# EAGLE design covert2temprouted (EAGLE 9.6.2)
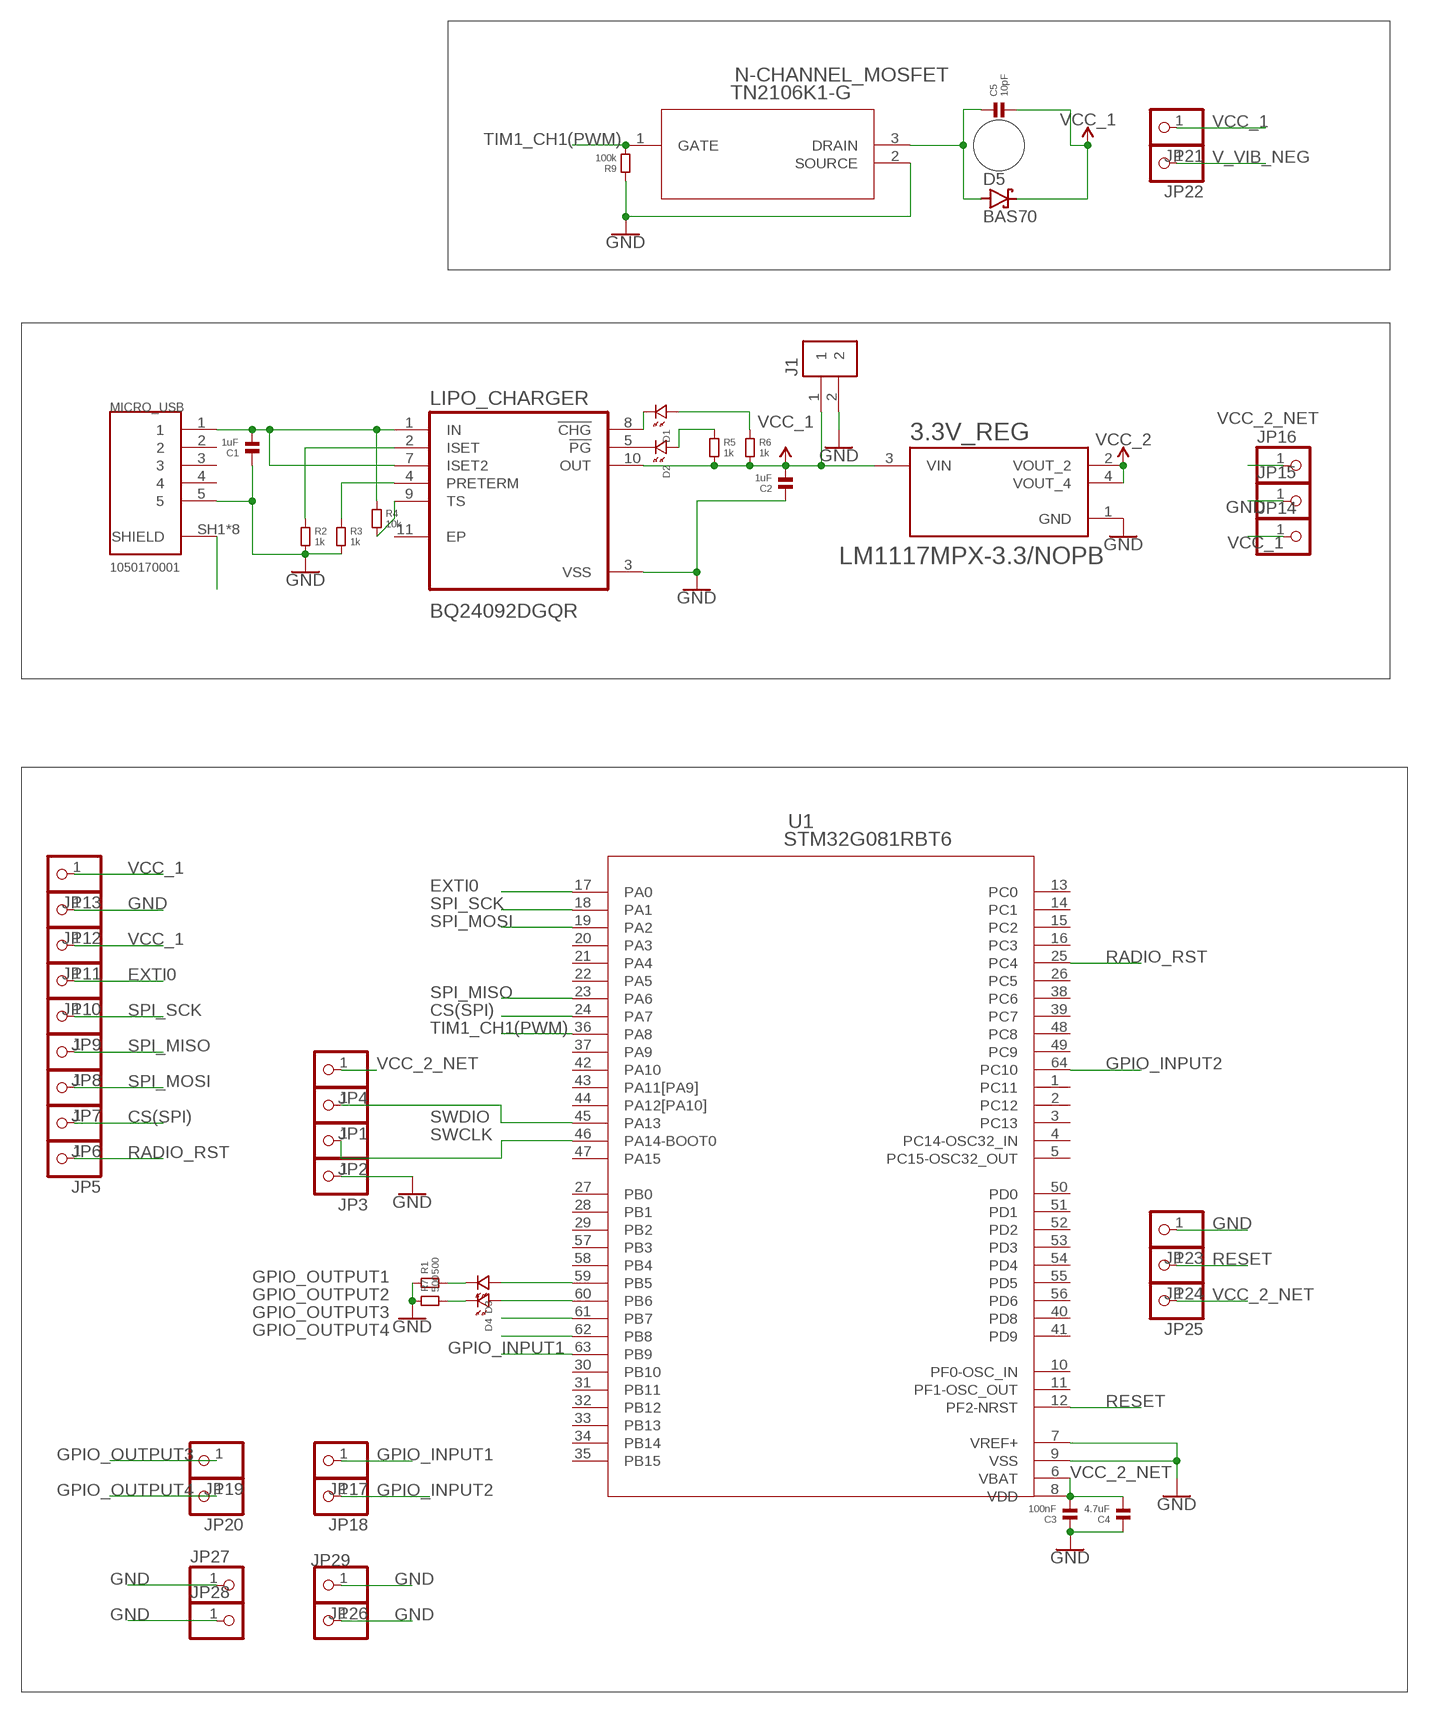
[diagram p0: schematic, sheet 1]

## Parts
3.3V_REG  LM1117MPX-3.3/NOPB  [VREG_LM1117MPX-3.3/NOPB]
C1  1uF  CAPACITOR.0805  [0805]
C2  1uF  CAPACITOR.0805  [0805]
C3  100nF  CAPACITOR.0805  [0805]
C4  4.7uF  CAPACITOR.0805  [0805]
C5  10pF  CAPACITOR.0805  [0805]
D1  LED.0805  [0805.LED]
D2  LED.0805  [0805.LED]
D3  LED.0805  [0805.LED]
D4  LED.0805  [0805.LED]
D5  BAS70  [SOT23]
J1  B2B-PH-K-S(LF)(SN)  [JST_B2B-PH-K-S(LF)(SN)]
JP1  PINHD-1X1  [1X01]
JP2  PINHD-1X1  [1X01]
JP3  PINHD-1X1  [1X01]
JP4  PINHD-1X1  [1X01]
JP5  PINHD-1X1  [1X01]
JP6  PINHD-1X1  [1X01]
JP7  PINHD-1X1  [1X01]
JP8  PINHD-1X1  [1X01]
JP9  PINHD-1X1  [1X01]
JP10  PINHD-1X1  [1X01]
JP11  PINHD-1X1  [1X01]
JP12  PINHD-1X1  [1X01]
JP13  PINHD-1X1  [1X01]
JP14  PINHD-1X1  [1X01]
JP15  PINHD-1X1  [1X01]
JP16  PINHD-1X1  [1X01]
JP17  PINHD-1X1  [1X01]
JP18  PINHD-1X1  [1X01]
JP19  PINHD-1X1  [1X01]
JP20  PINHD-1X1  [1X01]
JP21  PINHD-1X1  [1X01]
JP22  PINHD-1X1  [1X01]
JP23  PINHD-1X1  [1X01]
JP24  PINHD-1X1  [1X01]
JP25  PINHD-1X1  [1X01]
JP26  PINHD-1X1  [1X01]
JP27  PINHD-1X1  [1X01]
JP28  PINHD-1X1  [1X01]
JP29  PINHD-1X1  [1X01]
LIPO_CHARGER  BQ24092DGQR  [IC_XTR111AIDGQR]
MICRO_USB  1050170001  [MOLEX_1050170001]
N-CHANNEL_MOSFET  TN2106K1-G  [TO-236AB_MCH]
R1  500  RESISTOR.0805  [0805]
R2  1k  RESISTOR.0805  [0805]
R3  1k  RESISTOR.0805  [0805]
R4  10k  RESISTOR.0805  [0805]
R5  1k  RESISTOR.0805  [0805]
R6  1k  RESISTOR.0805  [0805]
R7  500  RESISTOR.0805  [0805]
R9  100k  RESISTOR.0805  [0805]
U1  STM32G081RBT6  [LQFP-64]

## Nets
5VUSB: C1.2 LIPO_CHARGER.1(IN) LIPO_CHARGER.7(ISET2) MICRO_USB.1 R4.1
CS(SPI): JP6.1 U1.24(PA7)
EXTI0: JP10.1 U1.17(PA0)
GND: 3.3V_REG.1(GND) C1.1 C2.1 C3.1 C4.1 J1.2 JP3.1 JP12.1 JP15.1 JP23.1 JP26.1 JP27.1 JP28.1 JP29.1 LIPO_CHARGER.3(VSS) MICRO_USB.5 N-CHANNEL_MOSFET.2(SOURCE) R1.1 R2.2 R3.2 R7.1 R9.1 U1.7(VREF+) U1.9(VSS)
GPIO_INPUT1: JP17.1 U1.63(PB9)
GPIO_INPUT2: JP18.1 U1.64(PC10)
GPIO_OUTPUT1: D3.P$1 U1.59(PB5)
GPIO_OUTPUT2: D4.P$1 U1.60(PB6)
GPIO_OUTPUT3: JP19.1 U1.61(PB7)
GPIO_OUTPUT4: JP20.1 U1.62(PB8)
N$1: LIPO_CHARGER.2(ISET) R2.1
N$2: LIPO_CHARGER.4(PRETERM) R3.1
N$3: LIPO_CHARGER.9(TS) R4.2
N$4: D4.P$2 R7.2
N$5: D2.P$1 R5.1
N$6: D1.P$1 R6.1
N$7: D2.P$2 LIPO_CHARGER.5(!PG)
N$9: D3.P$2 R1.2
N$11: D1.P$2 LIPO_CHARGER.8(!CHG)
RADIO_RST: JP5.1 U1.25(PC4)
RESET: JP24.1 U1.12(PF2-NRST)
SHIELD: MICRO_USB.SH1(SHIELD) MICRO_USB.SH2(SHIELD) MICRO_USB.SH3(SHIELD) MICRO_USB.SH4(SHIELD) MICRO_USB.SH5(SHIELD) MICRO_USB.SH6(SHIELD) MICRO_USB.SH7(SHIELD) MICRO_USB.SH8(SHIELD)
SPI_MISO: JP8.1 U1.23(PA6)
SPI_MOSI: JP7.1 U1.19(PA2)
SPI_SCK: JP9.1 U1.18(PA1)
SWCLK: JP2.1 U1.46(PA14-BOOT0)
SWDIO: JP1.1 U1.45(PA13)
TIM1_CH1(PWM): N-CHANNEL_MOSFET.1(GATE) R9.2 U1.36(PA8)
V_VIB_NEG: C5.1 D5.1(A) JP22.1 N-CHANNEL_MOSFET.3(DRAIN)
VCC_1: 3.3V_REG.3(VIN) C2.2 C5.2 D5.3(C) J1.1 JP11.1 JP13.1 JP14.1 JP21.1 LIPO_CHARGER.10(OUT) R5.2 R6.2
VCC_2_NET: 3.3V_REG.2(VOUT_2) 3.3V_REG.4(VOUT_4) C3.2 C4.2 JP4.1 JP16.1 JP25.1 U1.6(VBAT) U1.8(VDD) ; supply symbol labelled VCC_2
Unconnected: LIPO_CHARGER.11(EP) MICRO_USB.2 MICRO_USB.3 MICRO_USB.4 U1.1(PC11) U1.2(PC12) U1.3(PC13) U1.4(PC14-OSC32_IN) U1.5(PC15-OSC32_OUT) U1.10(PF0-OSC_IN) U1.11(PF1-OSC_OUT) U1.13(PC0) U1.14(PC1) U1.15(PC2) U1.16(PC3) U1.20(PA3) U1.21(PA4) U1.22(PA5) U1.26(PC5) U1.27(PB0) U1.28(PB1) U1.29(PB2) U1.30(PB10) U1.31(PB11) U1.32(PB12) U1.33(PB13) U1.34(PB14) U1.35(PB15) U1.37(PA9) U1.38(PC6) U1.39(PC7) U1.40(PD8) U1.41(PD9) U1.42(PA10) U1.43(PA11[PA9]) U1.44(PA12[PA10]) U1.47(PA15) U1.48(PC8) U1.49(PC9) U1.50(PD0) U1.51(PD1) U1.52(PD2) U1.53(PD3) U1.54(PD4) U1.55(PD5) U1.56(PD6) U1.57(PB3) U1.58(PB4)

## Library data of the parts
3.3V_REG = LM1117MPX-3.3_NOPB (1):LM1117MPX-3.3/NOPB: 800-mA 15-V linear voltage regulator 4-SOT-223 0 to 125; DESCRIPTION: 800-mA 15-V linear voltage regulator 4-SOT-223 0 to 125; DIGI-KEY_PART_NUMBER: LM1117MPX-3.3/NOPBCT-ND; MF: Texas Instruments; MP: LM1117MPX-3.3/NOPB; PACKAGE: SOT-223-4 Texas Instruments; PURCHASE-URL: https://pricing.snapeda.com/search/part/LM1117MPX-3.3/NOPB/?ref=eda
C1-C5 = standardparts:CAPACITOR
D1-D4 = standardparts:LED
D5 = diode:BAS70: Silicon Schottky Diodes General-purpose diode for high-speed switching
J1 = B2B-PH-K-S_LF__SN_:B2B-PH-K-S(LF)(SN): PH Series 2 Position 2 mm Pitch Through Hole Top Entry Shrouded Header; DESCRIPTION: Connector Header Through Hole 2 position 0.079 (2.00mm); DIGI-KEY_PART_NUMBER: 455-1704-ND; MF: JST Sales; MP: B2B-PH-K-S(LF)(SN); PACKAGE: None; PURCHASE-URL: https://pricing.snapeda.com/search/part/B2B-PH-K-S(LF)(SN)/?ref=eda
JP1-JP29 = pinhead:PINHD-1X1: PIN HEADER
LIPO_CHARGER = BQ24092DGQR:BQ24092DGQR; DESCRIPTION: 1-cell, 1-A, Li-ion battery charger with operation over JEITA and 10k? NTC 10-HVSSOP -40 to 150; DIGI-KEY_PART_NUMBER: 296-41204-1-ND; MF: Texas Instruments; MP: BQ24092DGQR; PACKAGE: HVSSOP-10 Texas Instruments; PURCHASE-URL: https://pricing.snapeda.com/search/part/BQ24092DGQR/?ref=eda
MICRO_USB = 1050170001:1050170001: Conn.; Data; USB; Recept.; Micro; B Type; Bottom Mount, SMT, with Solder Tabs, Lead-Free; DESCRIPTION: USB - micro B USB 2.0 Receptacle Connector 5 Position Surface Mount, Right Angle; Through Hole; DIGI-KEY_PART_NUMBER: WM1399CT-ND; MF: Molex; MP: 1050170001; PACKAGE: None; PURCHASE-URL: https://pricing.snapeda.com/search/part/1050170001/?ref=eda
N-CHANNEL_MOSFET = TN2106K1-G (MOSFET):TN2106K1-G; BUILT_BY: EMA_Jessica; COPYRIGHT: Copyright (C) 2018 Accelerated Designs. All rights reserved; MANUFACTURER_PART_NUMBER: TN2106K1-G; SOURCELIBRARY: Update_to_database_2020-12-30; VENDOR: Microchip
R1-R7 R9 = standardparts:RESISTOR
U1 = STM32G081RBT6v3:STM32G081RBT6; BUILT_BY: EMA_UL_Team; COPYRIGHT: Copyright (C) 2018 Accelerated Designs. All rights reserved; MANUFACTURER_PART_NUMBER: STM32G081RBT6; SOURCELIBRARY: Updates_to_database_2020-10-19; VENDOR: STMicroelectronics

## Board
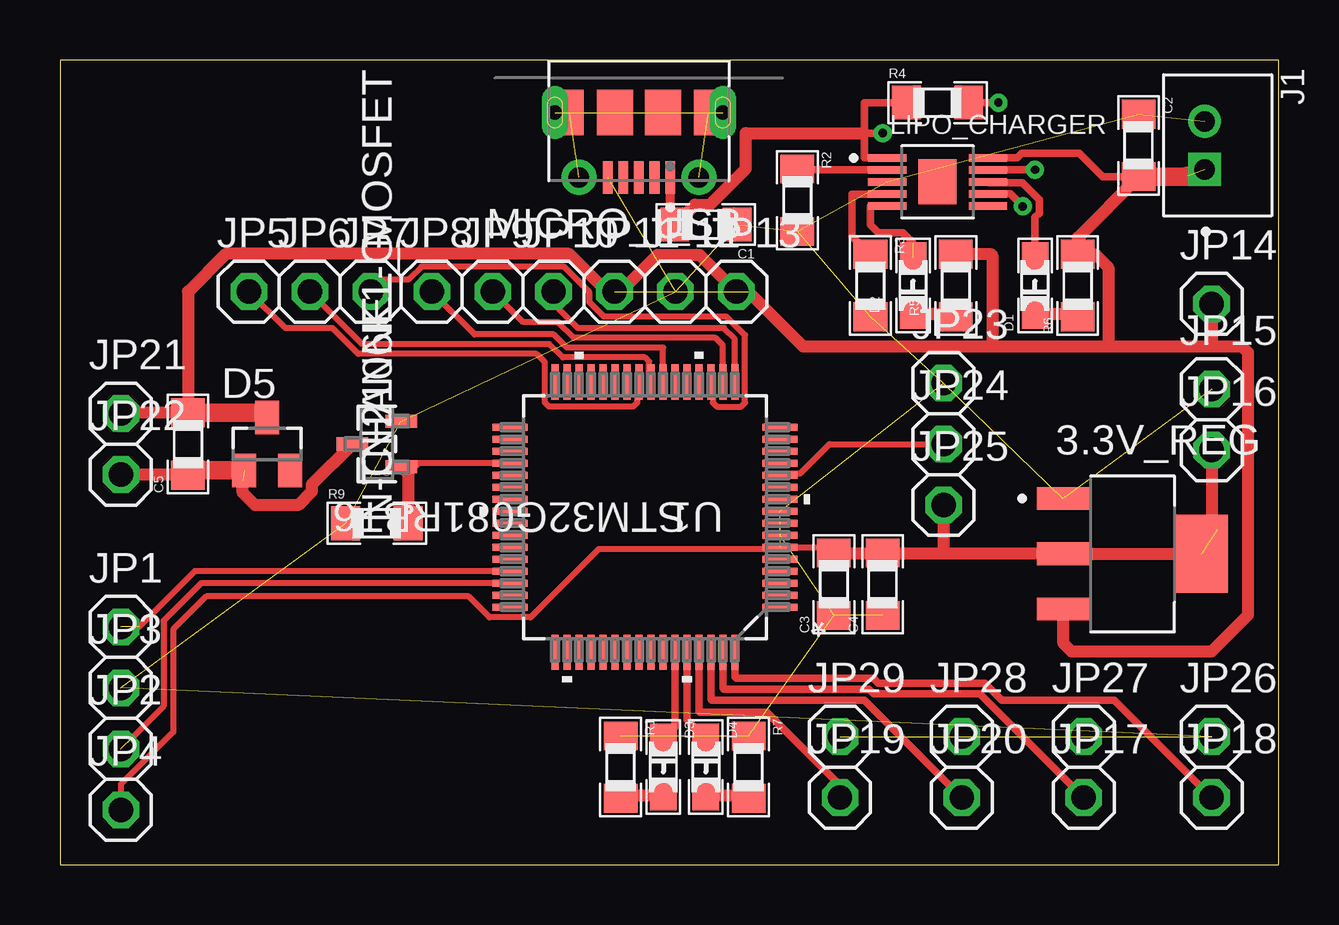
[diagram p1: board, top side]
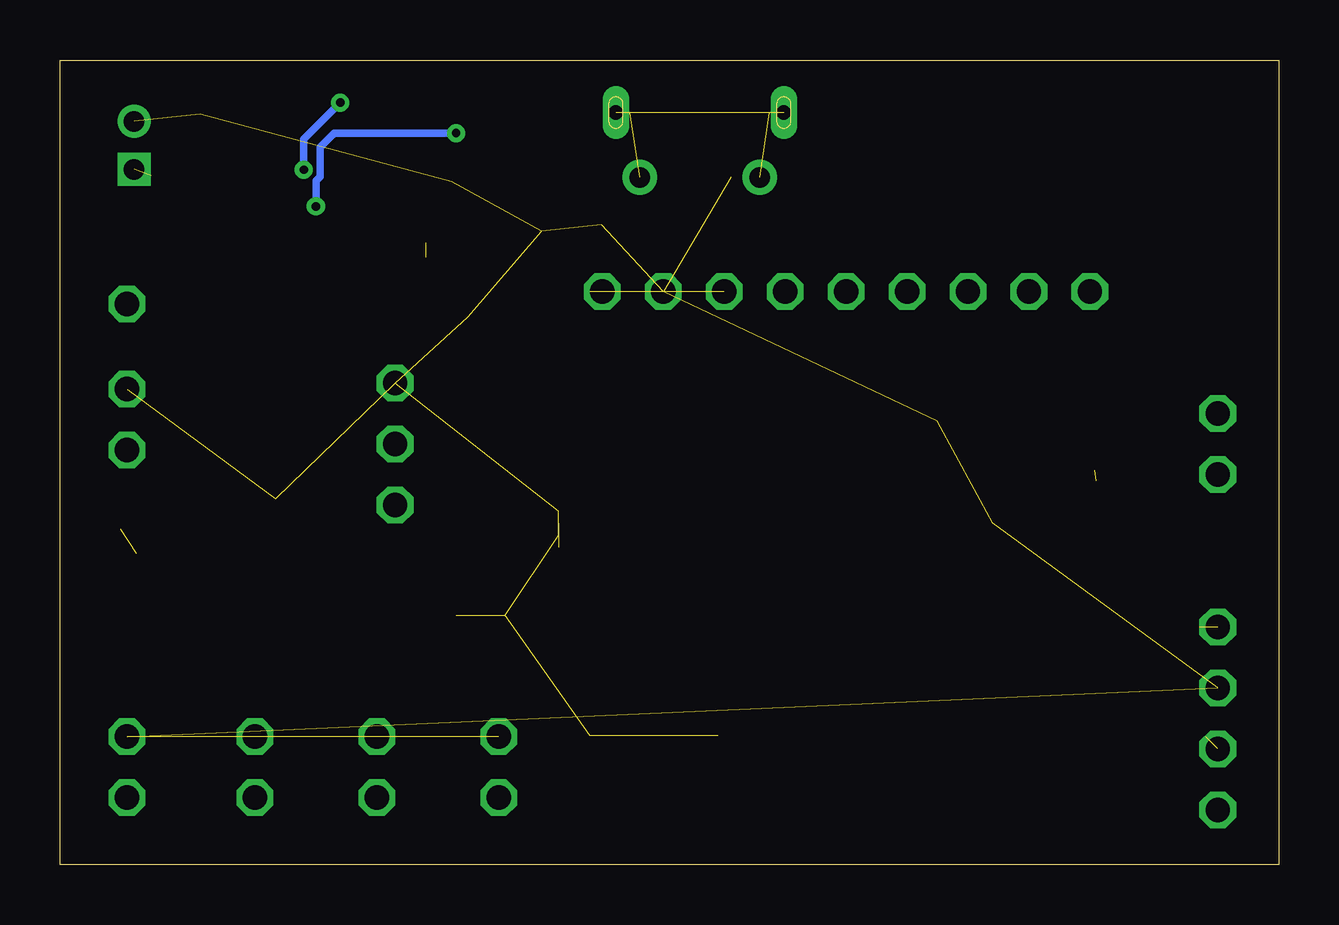
[diagram p2: board, bottom side, seen from below]

Size 50.8 x 33.53 mm. Coordinates in mm from the lower left corner, seen from the top.
Outline: 0,0 50.8,0 50.8,33.53 0,33.53 0,0
Copper layers (1*16): Top 0.035mm / dielectric 1.5mm / Bottom 0.035mm
Design rules "default": minimum track width 6mil, minimum drill 0.35mm, track to track 6mil, track to pad 6mil, pad to pad 6mil, via to via 6mil, smd to smd 6mil, copper to edge 40mil, drill to drill 6mil, minimum pad ring 10mil, minimum via ring 8mil, stop-mask expansion 4mil, vias tented up to drill 0mil, thermal gap 10mil

### Footprints (pad centres in the part's own frame; a part is rotated, then mirrored left to right if it is on the bottom)
VREG_LM1117MPX-3.3/NOPB = smd 2.15 x 0.95: 1 -2.9,2.3; 2 -2.9,0; 3 -2.9,-2.3 | smd 2.15 x 3.25: 4 2.9,0
0805 = smd 1.2 x 1.4: 1 -1.3,0; 2 1.3,0
0805.LED = smd 1.25 x 1.1: P$1 -1.175,0; P$2 1.175,0
SOT23 = smd 1 x 1.4: 1 -0.95,-1.1; 2 0.95,-1.1; 3 0,1.1
JST_B2B-PH-K-S(LF)(SN) = drill 0.86 square: 1 1,-0.55 | drill 0.86: 2 -1,-0.55
1X01 = drill 1.016 octagon: 1 0,0
IC_XTR111AIDGQR = smd 1.6 x 0.3: 1 -2.1,1; 2 -2.1,0.5; 3 -2.1,0; 4 -2.1,-0.5; 5 -2.1,-1; 6 2.1,-1; 7 2.1,-0.5; 8 2.1,0; 9 2.1,0.5; 10 2.1,1 | smd 1.57 x 1.88: 11 0,0
MOLEX_1050170001 = smd 0.4 x 1.35: 1 -1.3,2.35; 2 -0.65,2.35; 3 0,2.35; 4 0.65,2.35; 5 1.3,2.35 | drill 0.85 pad 1.45: SH1 -2.5,2.35; SH2 2.5,2.35 | drill 0.6 pad 0.95 long: SH3 -3.5,-0.35; SH8 3.5,-0.35 | smd 1.2 x 1.9: SH4 -2.9,-0.35; SH7 2.9,-0.35 | smd 1.5 x 1.9: SH5 -1,-0.35; SH6 1,-0.35
TO-236AB_MCH = smd 0.551 x 1.311: 1 -0.95,-1.02; 2 0.95,-1.02; 3 0,1.02
LQFP-64 = smd 1.473 x 0.279: 1 -5.626,3.75; 2 -5.626,3.25; 3 -5.626,2.75; 4 -5.626,2.25; 5 -5.626,1.75; 6 -5.626,1.25; 7 -5.626,0.75; 8 -5.626,0.25; 9 -5.626,-0.25; 10 -5.626,-0.75; 11 -5.626,-1.25; 12 -5.626,-1.75; 13 -5.626,-2.25; 14 -5.626,-2.75; 15 -5.626,-3.25; 16 -5.626,-3.75; 33 5.626,-3.75; 34 5.626,-3.25; 35 5.626,-2.75; 36 5.626,-2.25; 37 5.626,-1.75; 38 5.626,-1.25; 39 5.626,-0.75; 40 5.626,-0.25; 41 5.626,0.25; 42 5.626,0.75; 43 5.626,1.25; 44 5.626,1.75; 45 5.626,2.25; 46 5.626,2.75; 47 5.626,3.25; 48 5.626,3.75 | smd 0.279 x 1.473: 17 -3.75,-5.626; 18 -3.25,-5.626; 19 -2.75,-5.626; 20 -2.25,-5.626; 21 -1.75,-5.626; 22 -1.25,-5.626; 23 -0.75,-5.626; 24 -0.25,-5.626; 25 0.25,-5.626; 26 0.75,-5.626; 27 1.25,-5.626; 28 1.75,-5.626; 29 2.25,-5.626; 30 2.75,-5.626; 31 3.25,-5.626; 32 3.75,-5.626; 49 3.75,5.626; 50 3.25,5.626; 51 2.75,5.626; 52 2.25,5.626; 53 1.75,5.626; 54 1.25,5.626; 55 0.75,5.626; 56 0.25,5.626; 57 -0.25,5.626; 58 -0.75,5.626; 59 -1.25,5.626; 60 -1.75,5.626; 61 -2.25,5.626; 62 -2.75,5.626; 63 -3.25,5.626; 64 -3.75,5.626

### Placement (x,y rotation side)
3.3V_REG  44.7,12.95 0 top
C1  26.92,26.67 180 top
C2  44.96,29.97 270 top
C3  32.26,11.68 90 top
C4  34.29,11.68 90 top
C5  5.33,17.53 90 top
D1  40.64,24.13 90 top
D2  35.56,24.13 90 top
D3  25.15,4.06 270 top
D4  26.92,4.06 270 top
D5  8.64,17.53 0 top
J1  48.26,29.97 270 top
JP1  2.54,9.91 0 top
JP2  2.54,4.83 0 top
JP3  2.54,7.37 0 top
JP4  2.54,2.29 0 top
JP5  7.87,23.88 0 top
JP6  10.41,23.88 0 top
JP7  12.95,23.88 0 top
JP8  15.49,23.88 0 top
JP9  18.03,23.88 0 top
JP10  20.57,23.88 0 top
JP11  23.11,23.88 0 top
JP12  25.65,23.88 0 top
JP13  28.19,23.88 0 top
JP14  48.01,23.37 0 top
JP15  48.01,19.81 0 top
JP16  48.01,17.27 0 top
JP17  42.67,2.79 0 top
JP18  48.01,2.79 0 top
JP19  32.51,2.79 0 top
JP20  37.59,2.79 0 top
JP21  2.54,18.8 0 top
JP22  2.54,16.26 0 top
JP23  36.83,20.07 0 top
JP24  36.83,17.53 0 top
JP25  36.83,14.99 0 top
JP26  48.01,5.33 0 top
JP27  42.67,5.33 0 top
JP28  37.59,5.33 0 top
JP29  32.51,5.33 0 top
LIPO_CHARGER  36.58,28.45 0 top
MICRO_USB  24.13,30.99 180 top
N-CHANNEL_MOSFET  13.21,17.53 90 top
R1  23.37,4.06 270 top
R2  30.73,27.69 270 top
R3  33.78,24.13 270 top
R4  36.58,31.75 0 top
R5  37.34,24.13 90 top
R6  42.42,24.13 90 top
R7  28.7,4.06 270 top
R9  13.21,14.22 0 top
U1  24.38,14.48 180 top

### Tracks (layer width: path | path; a pad name or v marks a point on that pad's centre or on a via)
5VUSB  (via drill 0.35)
  Top 0.305: LIPO_CHARGER.1 34.46,29.46 33.53,29.46 33.53,30.48 | 33.53,30.48 33.53,31.75 R4.1 | 33.53,30.48 v34.29,30.48 | LIPO_CHARGER.7 39.62,27.95 v40.13,27.43
  Top 0.381: MICRO_USB.1 25.43,26.86 C1.2
  Top 0.508: C1.2 26.46,27.51 27.1,27.51 28.59,29 28.59,30.48 33.53,30.48
  Bottom 0.305: v34.29,30.48 39.37,30.48 39.96,29.89 39.96,28.67 40.13,28.5 v40.13,27.43
CS(SPI)
  Top 0.254: U1.24 24.55,20.18 24.55,20.96 24.38,21.13 20.96,21.13 20.41,21.69 17.78,21.69 17.53,21.69 12.6,21.69 JP6.1
EXTI0
  Top 0.254: U1.17 28.13,21.9 27.69,22.35 21.59,22.35 20.57,23.37 JP10.1
GND  (23 unrouted)
GPIO_INPUT1
  Top 0.305: U1.63 27.63,7.37 27.69,7.32 33.72,7.32 33.92,7.11 38.35,7.11 JP17.1
GPIO_INPUT2
  Top 0.305: U1.64 28.13,7.83 28.19,7.77 33.91,7.77 34.11,7.57 38.54,7.57 39.26,6.86 43.94,6.86 JP18.1
GPIO_OUTPUT1
  Top 0.305: U1.59 25.63,5.73 D3.P$1
GPIO_OUTPUT2
  Top 0.305: U1.60 26.13,6.03 D4.P$1
GPIO_OUTPUT3
  Top 0.305: U1.61 26.63,6.39 26.67,6.35 29.46,6.35 32.51,3.3 JP19.1
GPIO_OUTPUT4
  Top 0.305: U1.62 27.13,6.9 27.18,6.86 33.53,6.86 JP20.1
N$1
  Top 0.305: LIPO_CHARGER.2 30.77,28.95 R2.1
N$2
  Top 0.305: LIPO_CHARGER.4 34.47,27.94 33.02,27.94 33.02,26.19 R3.1
N$3  (via drill 0.35)
  Top 0.305: LIPO_CHARGER.9 v40.64,28.96 | v39.12,31.75 R4.2
  Bottom 0.305: v40.64,28.96 40.64,30.23 v39.12,31.75
N$4
  Top 0.508: R7.2 28.58,2.89 D4.P$2
N$5
  Top 0.508: D2.P$1 37.34,22.95 R5.1
N$6
  Top 0.508: R6.1 42.29,22.95 D1.P$1
N$7  (1 unrouted)
  Top 0.305: LIPO_CHARGER.5 34.46,27.43 33.78,27.43 33.78,26.67 34.12,26.34 35.13,26.34 35.56,25.91
N$9
  Top 0.508: R1.2 23.49,2.89 D3.P$2
N$11
  Top 0.305: LIPO_CHARGER.8 38.72,28.41 40.12,28.41 40.81,27.71 40.81,27.15 40.64,26.97 D1.P$2
RADIO_RST
  Top 0.254: U1.25 24.05,20.02 24.05,19.25 23.89,19.09 20.38,19.09 20.21,19.25 20.21,20.93 19.86,21.29 12.43,21.29 11.36,22.35 9.4,22.35 JP5.1
RESET
  Top 0.254: U1.12 30.09,16.31 30.86,16.31 32.08,17.53 JP24.1
SHIELD  (7 unrouted)
SPI_MISO
  Top 0.254: U1.23 25.13,21.53 25.15,21.54 21.13,21.54 20.57,22.1 17.27,22.1 JP8.1
SPI_MOSI
  Top 0.254: JP7.1 13.46,24.38 14.53,24.38 15.06,24.92 21,24.92 22.07,23.85 22.07,23.45 22.68,22.84 27.78,22.84 28.55,22.06 28.55,19.25 28.39,19.09 27.38,19.09 27.21,19.25 27.21,20.02 U1.19
SPI_SCK
  Top 0.254: U1.18 27.63,21.64 27.33,21.95 21.42,21.95 20.76,22.61 19.3,22.61 JP9.1
SWCLK  (1 unrouted)
  Top 0.254: U1.46 5.89,11.73 4.32,10.16 4.32,6.6 3.05,5.33
SWDIO  (1 unrouted)
  Top 0.254: U1.45 5.62,12.23 3.3,9.91
TIM1_CH1(PWM)
  Top 0.254: U1.36 14.94,16.73 14.51,16.3
  Top 0.508: N-CHANNEL_MOSFET.1 14.51,16.3 R9.2
V_VIB_NEG  (1 unrouted)
  Top 0.508: N-CHANNEL_MOSFET.3 10.49,15.83 10.49,15.56 9.92,14.99 8.13,14.99 7.62,15.49 7.62,16 | C5.1 5.3,16.26 JP22.1
  Top 0.762: 5.33,16.26 C5.1 5.53,16.43 D5.1
VCC_1  (2 unrouted)
  Top 0.305: LIPO_CHARGER.10 39.91,29.45 40.1,29.64 42.5,29.64 43.46,28.67 C2.2
  Top 0.508: C2.2 42.42,26.13 R6.2 43.15,25.43 43.69,24.89 43.69,21.59 | 43.69,21.59 38.86,21.59 | 38.86,21.59 38.86,25.4 38.83,25.43 R5.2 | 38.86,21.59 30.99,21.59 28.7,23.88 | JP13.1 26.67,25.4 24.89,25.4 23.37,23.88 JP11.1 22.8,23.88 21.23,25.45 6.91,25.45 5.33,23.88 C5.2 2.57,18.83 JP21.1 | 3.3V_REG.3 41.8,9.25 42.16,8.89 48.01,8.89 49.53,10.41 49.53,21.34 49.28,21.59 48.01,21.59 | 48.01,21.59 43.69,21.59 | JP14.1 48.01,21.59
  Top 0.762: C2.2 46.96,28.67 46.99,28.7 | 5.11,19.05 C5.2 8.44,18.83 D5.3
VCC_2_NET  (2 unrouted)
  Top 0.254: C3.2 32.01,13.23 U1.6 29.93,13.15 22.45,13.15 19.61,10.31 17.91,10.31 17.04,11.18 6.1,11.18 4.72,9.8 4.72,5.54 2.54,3.35 JP4.1
  Top 0.508: C3.2 C4.2 36.83,12.98 | 36.83,12.98 41.77,12.98 3.3V_REG.2 3.3V_REG.4 | JP16.1 48.01,13.97 48.26,13.97 | JP25.1 36.83,12.98